# Altium project 一体化.PrjPCB
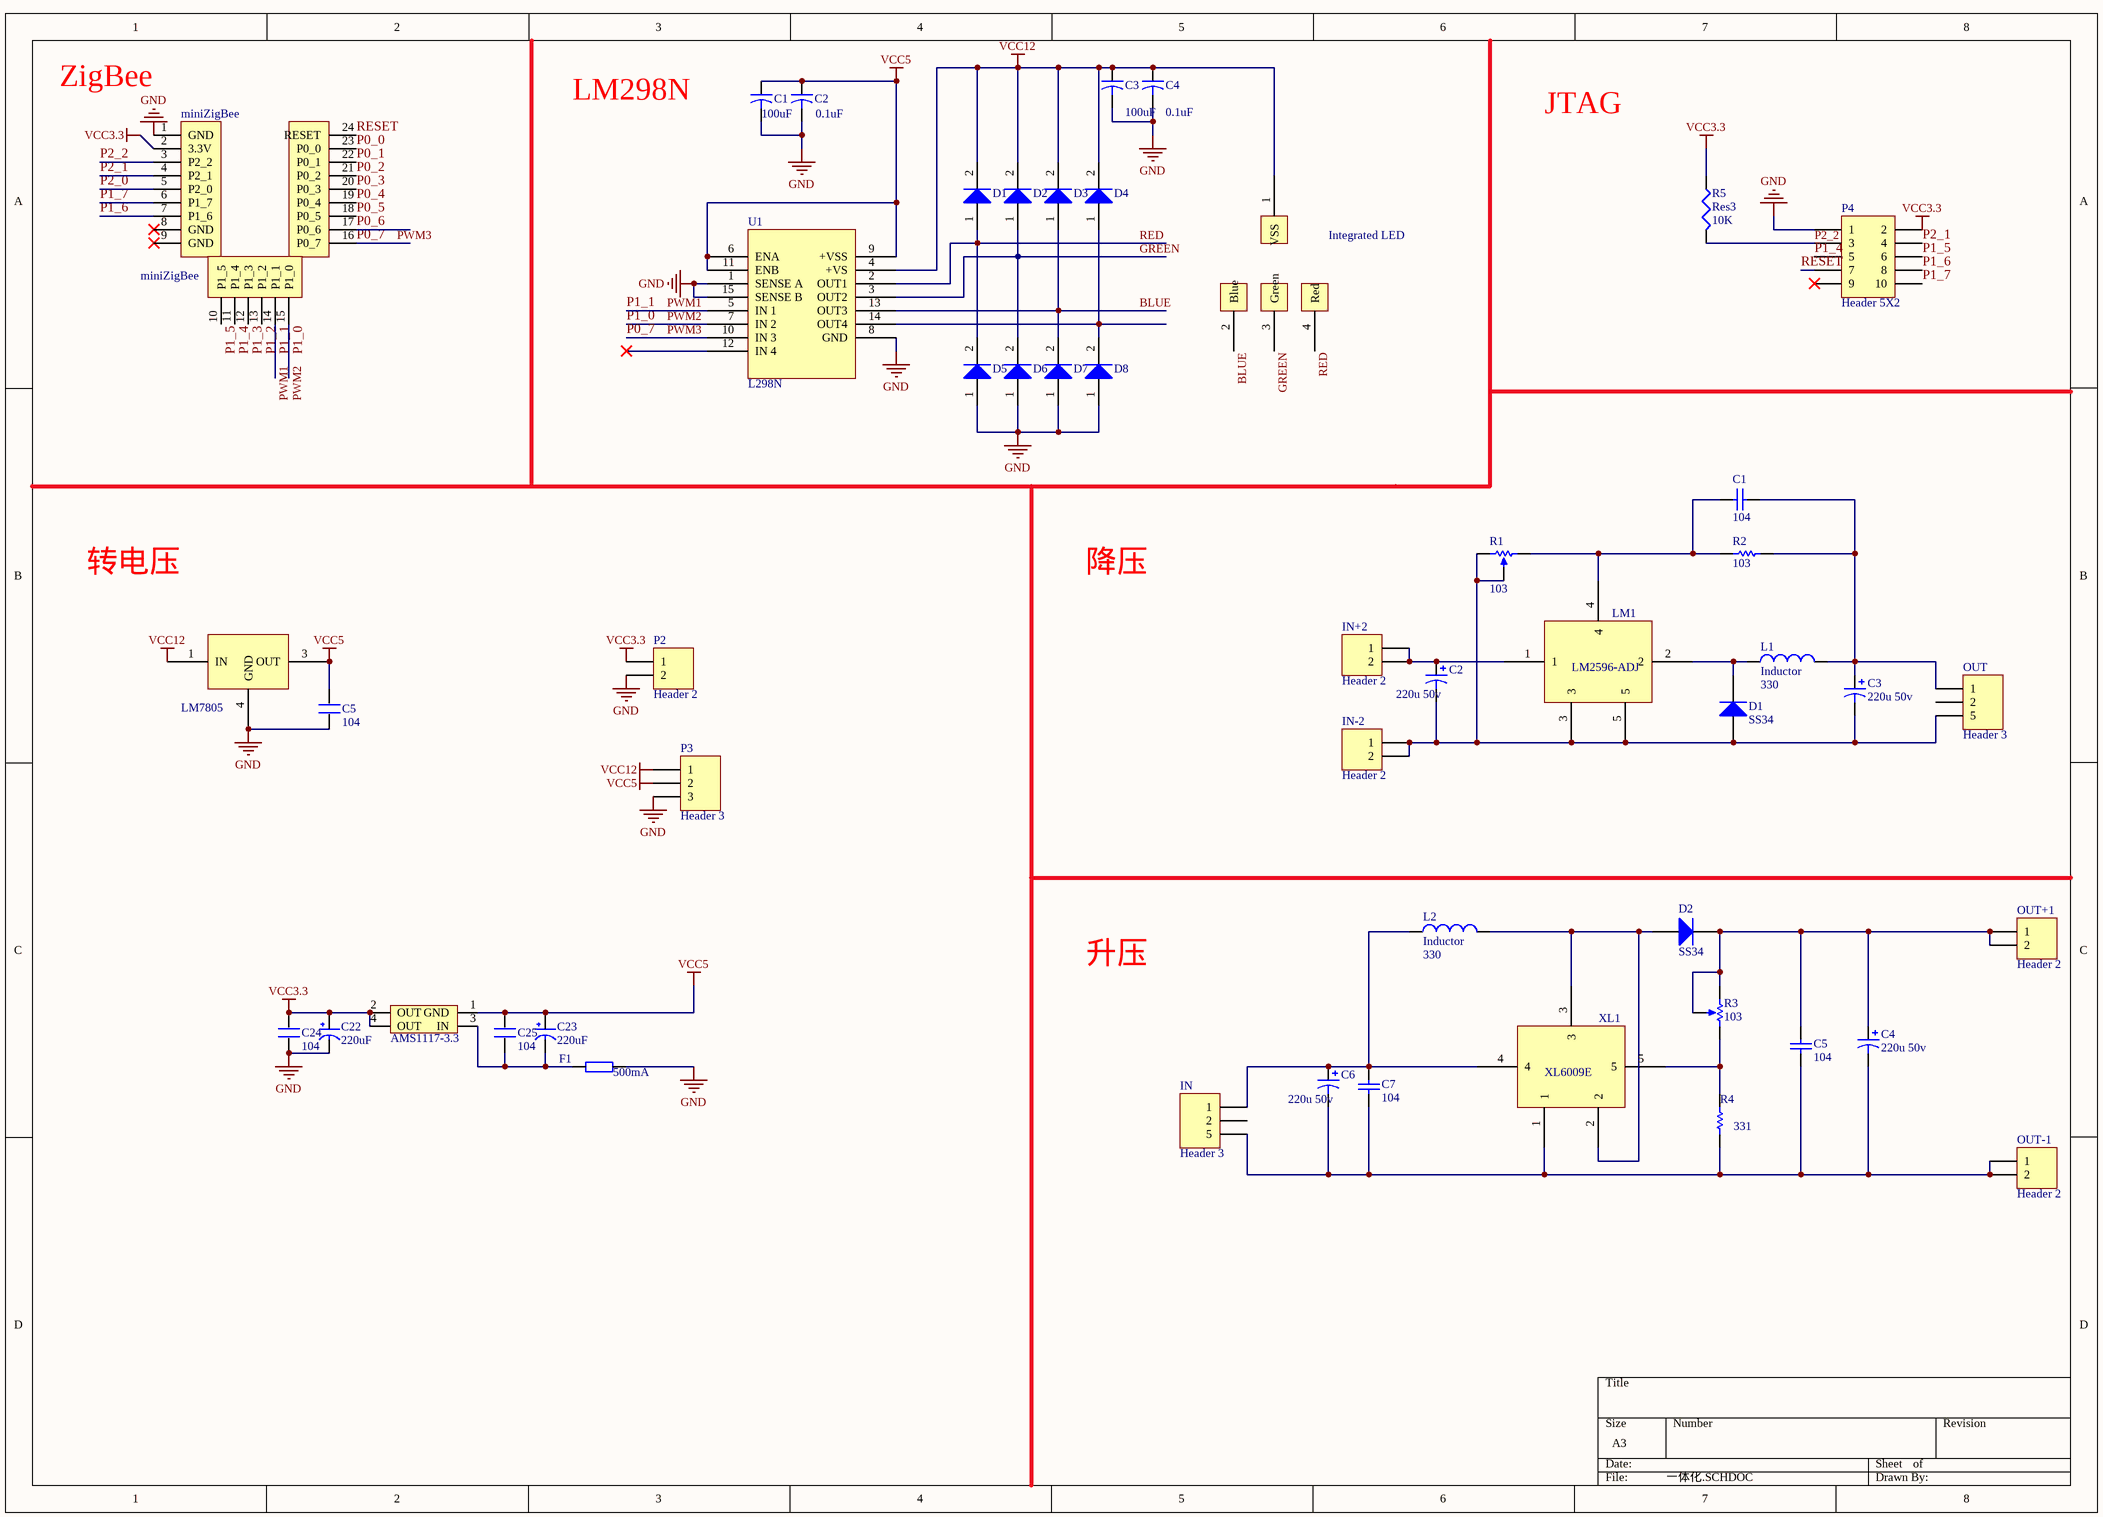
[diagram p0: 一体化.SCHDOC]
1 sheet, 50 parts. Net scope: global (net labels, ports and power ports of the same name join across sheets).
Board file: 一体化.PcbDoc

## Sheet 一体化.SCHDOC
size A3

### Parts
(Parts that share a designator on the sheet are numbered #1, #2 ... from top to bottom, then left to right.)
C1#1  value 100uF  [PCBComponent_1]
C1#2  104  [C1206]
C2#1  value 0.1uF  [PCBComponent_1]
C2#2  220u 50v  [ABSM-1574]
C3#1  value 100uF  [PCBComponent_1]
C3#2  220u 50v  [ABSM-1574]
C4#1  value 0.1uF  [PCBComponent_1]
C4#2  220u 50v  [ABSM-1574]
C5#1  104  [0603P]
C5#2  104  [C1206]
C6  220u 50v  [ABSM-1574]
C7  104  [C1206]
C22  220uF  [CC6.56.5]
C23  220uF  [CC6.56.5]
C24  104  [0603P]
C25  104  [0603P]
D1#1  IN4007  [IN4007]  (value not drawn)
D1#2  SS34  [SMC]
D2#1  IN4007  [IN4007]  (value not drawn)
D2#2  SS34  [SMC]
D3  IN4007  [IN4007]  (value not drawn)
D4  IN4007  [IN4007]  (value not drawn)
D5  IN4007  [IN4007]  (value not drawn)
D6  IN4007  [IN4007]  (value not drawn)
D7  IN4007  [IN4007]  (value not drawn)
D8  IN4007  [IN4007]  (value not drawn)
F1  500mA  [0603P]
IN  Header 3  [HDR1X5]
IN+2  Header 2  [HDR2X2]
IN-2  Header 2  [HDR2X2]
Integrated_LED  Integrated LED  [Integrated LED]  (value not drawn)
L1  Inductor  value 330  [l]
L2  Inductor  value 330  [l]
LM1  Component_1  [d2]  (value not drawn)
LM7805  LM7805  [LM7805]  (value not drawn)
miniZigBee  miniZigBee  [miniZigBee]
OUT  Header 3  [HDR1X5]
OUT+1  Header 2  [HDR2X2]
OUT-1  Header 2  [HDR2X2]
P2  Header 2  [HDR1X2]
P3  Header 3  [HDR1X3]
P4  Header 5X2  [HDR2X5]
R1  103  [HDR1X5]
R2  103  [C1206]
R3  103  [HDR1X3]
R4  331  [C1206]
R5  Res3  value 10K  [J1-0603]
U1  L298N  [L298N - duplicate]
U6  AMS1117-3.3  [AMS1117]
XL1  XL6009e  [d2]  (value not drawn)

### Nets
GND: C1#1.2 C2#1.2 C3#1.2 C4#1.2 C5#1.1 C22.2(GND) C24.1 D5.1(A) D6.1(A) D7.1(A) D8.1(A) F1.2 LM7805.4(GND) miniZigBee.1(GND) P2.2 P3.3 P4.1 U1.1(SENSE_A) U1.8(GND) U1.15(SENSE_B)
VCC3.3: C22.1(VCC) C24.2 miniZigBee.2(3.3V) P2.1 P4.2 R5.1 U6.2(OUT) U6.4(OUT)
VCC5: C1#1.1 C2#1.1 C5#1.2 C23.1(VCC) C25.2 LM7805.3(OUT) P3.2 U1.6(ENA) U1.9(+VSS) U1.11(ENB) U6.1(GND)
VCC12: C3#1.1 C4#1.1 D1#1.2(K) D2#1.2(K) D3.2(K) D4.2(K) Integrated_LED.1(VSS) LM7805.1(IN) P3.1 U1.4(+VS)
BLUE: D3.1(A) D7.2(K) Integrated_LED.2(Blue) U1.13(OUT3)
GREEN: D2#1.1(A) D6.2(K) Integrated_LED.3(Green) U1.3(OUT2)
P0_0: miniZigBee.23(P0_0)
P0_1: miniZigBee.22(P0_1)
P0_2: miniZigBee.21(P0_2)
P0_3: miniZigBee.20(P0_3)
P0_4: miniZigBee.19(P0_4)
P0_5: miniZigBee.18(P0_5)
P0_6: miniZigBee.17(P0_6)
P0_7: miniZigBee.16(P0_7) U1.10(IN_3)  [also labelled PWM3]
P1_0: miniZigBee.15(P1_0) U1.7(IN_2)  [also labelled PWM2]
P1_1: miniZigBee.14(P1_1) U1.5(IN_1)  [also labelled PWM1]
P1_2: miniZigBee.13(P1_2)
P1_3: miniZigBee.12(P1_3)
P1_4: miniZigBee.11(P1_4) P4.5
P1_5: miniZigBee.10(P1_5) P4.6
P1_6: miniZigBee.7(P1_6) P4.8
P1_7: miniZigBee.6(P1_7) P4.10
P2_0: miniZigBee.5(P2_0)
P2_1: miniZigBee.4(P2_1) P4.4
P2_2: miniZigBee.3(P2_2) P4.3 R5.2
RED: D1#1.1(A) D5.2(K) Integrated_LED.4(Red) U1.2(OUT1)
RESET: miniZigBee.24(RESET) P4.7
NetC1#2_1: C1#2.1 LM1.4 R1.1(BOT) R2.1
NetC1#2_2: C1#2.2 C3#2.1 L1.0 OUT.1 R2.2
NetC2#2_1: C2#2.1 IN+2.1 IN+2.2 LM1.1
NetC2#2_2: C2#2.2 C3#2.2 D1#2.1(A) IN-2.1 IN-2.2 LM1.3 LM1.5 OUT.5 R1.3(TAP) R1.5(TOP)
NetC4#2_1: C4#2.1 C5#2.2 D2#2.2(K) OUT+1.1 OUT+1.2 R3.2(TAP) R3.3(TOP)
NetC4#2_2: C4#2.2 C5#2.1 C6.2 C7.1 IN.5 OUT-1.1 OUT-1.2 R4.1 XL1.1
NetC6_1: C6.1 C7.2 IN.1 L2.1 XL1.4
NetC23_2: C23.2(GND) C25.1 F1.1 U6.3(IN)
NetD1#2_2: D1#2.2(K) L1.1 LM1.2
NetD2#2_1: D2#2.1(A) L2.0 XL1.2 XL1.3
NetD4_1: D4.1(A) D8.2(K) U1.14(OUT4)
NetR3_1: R3.1(BOT) R4.2 XL1.5

Not connected (* = marked no-connect by the designer): IN 2; miniZigBee 8(GND)* 9(GND)*; OUT 2; P4 9*; U1 12(IN_4)*

### Notes on the sheet
- (near miniZigBee) ZigBee
- LM298N
- JTAG
- 转电压
- 降压
- 升压
- (in symbol Component_1) LM2596-ADJ
- (in symbol XL6009e) XL6009E

### Library data of the parts
C1#1 C2#1 C3#1 C4#1 = Cap2: Capacitor; Published: 23-Sep-2002; PackageReference: CAPR5-4X5; Publisher: Altium Limited
C1#2 C5#2 C7 = Cap: Capacitor; Value: 100pF; Published: 8-Jun-2000; LatestRevisionDate: 17-Jul-2002; LatestRevisionNote: Re-released for DXP Platform.; PackageReference: RAD-0.3; Publisher: Altium Limited
C2#2 C3#2 C4#2 C6 = Cap Pol1: Polarized Capacitor (Radial); Value: 100pF; Published: 8-Jun-2000; LatestRevisionDate: 17-Jul-2002; LatestRevisionNote: Re-released for DXP Platform.; PackageReference: RB7.6-15; Publisher: Altium Limited
C5#1 C24 C25 = C
C22 C23 = CAP
D1#2 D2#2 = Diode: Default Diode; Published: 8-Jun-2000; LatestRevisionDate: 17-Jul-2002; LatestRevisionNote: Re-released for DXP Platform.; PackageDocument: Sep-1996; PackageReference: SMC; Publisher: Altium Limited; Code_JEDEC: DO-214-AB
F1 = R
IN OUT P3 = Header 3: Header, 3-Pin; LatestRevisionDate: 17-Jul-2002; LatestRevisionNote: Re-released for DXP Platform.; Publisher: Altium Limited
IN+2 IN-2 OUT+1 OUT-1 P2 = Header 2: Header, 2-Pin; LatestRevisionDate: 17-Jul-2002; LatestRevisionNote: Re-released for DXP Platform.; Publisher: Altium Limited
L1 L2 = Inductor: Code_IEC: 1005; Published: 8-Jun-2000; LatestRevisionDate: 17-Jul-2002; LatestRevisionNote: Re-released for DXP Platform.; PackageReference: 0402-A; Publisher: Altium Limited; Code_JEITA: 0402
P4 = Header 5X2: Header, 5-Pin, Dual row; LatestRevisionDate: 17-Jul-2002; LatestRevisionNote: Re-released for DXP Platform.; Publisher: Altium Limited
R1 R3 = RPot: Potentiometer; Sim Note: Enter the Resistance value and the set point into parameter fields.; Set Position: 0.5; Value: 1K; Published: 8-Jun-2000; LatestRevisionDate: 17-Jul-2002; LatestRevisionNote: Re-released for DXP Platform.; PackageReference: VR5; Publisher: Altium Limited
R2 R4 = Res1: Resistor; Value: 1K; Published: 8-Jun-2000; LatestRevisionDate: 17-Jul-2002; LatestRevisionNote: Re-released for DXP Platform.; PackageReference: AXIAL-0.3; Publisher: Altium Limited
R5 = Res3: Resistor; Published: 8-Jun-2000; LatestRevisionDate: 29-May-2009; LatestRevisionNote: IPC-7351 Footprint Added.; PackageReference: J1-0603; Publisher: Altium Limited; PackageDescription: Chip Resistor
U6 = AMS1117